# EasyEDA Pro project R7FA2E1A7_LED.eprj

# Schematic Schematic1
Create Date: 2023-08-11; Page Name: P1; Project Name: R7FA2E1A7_LED; Schematic Name: Schematic1; Update Date: 2023-08-11; Company: 嘉立创EDA; Page Size: A4; Version: V1.0
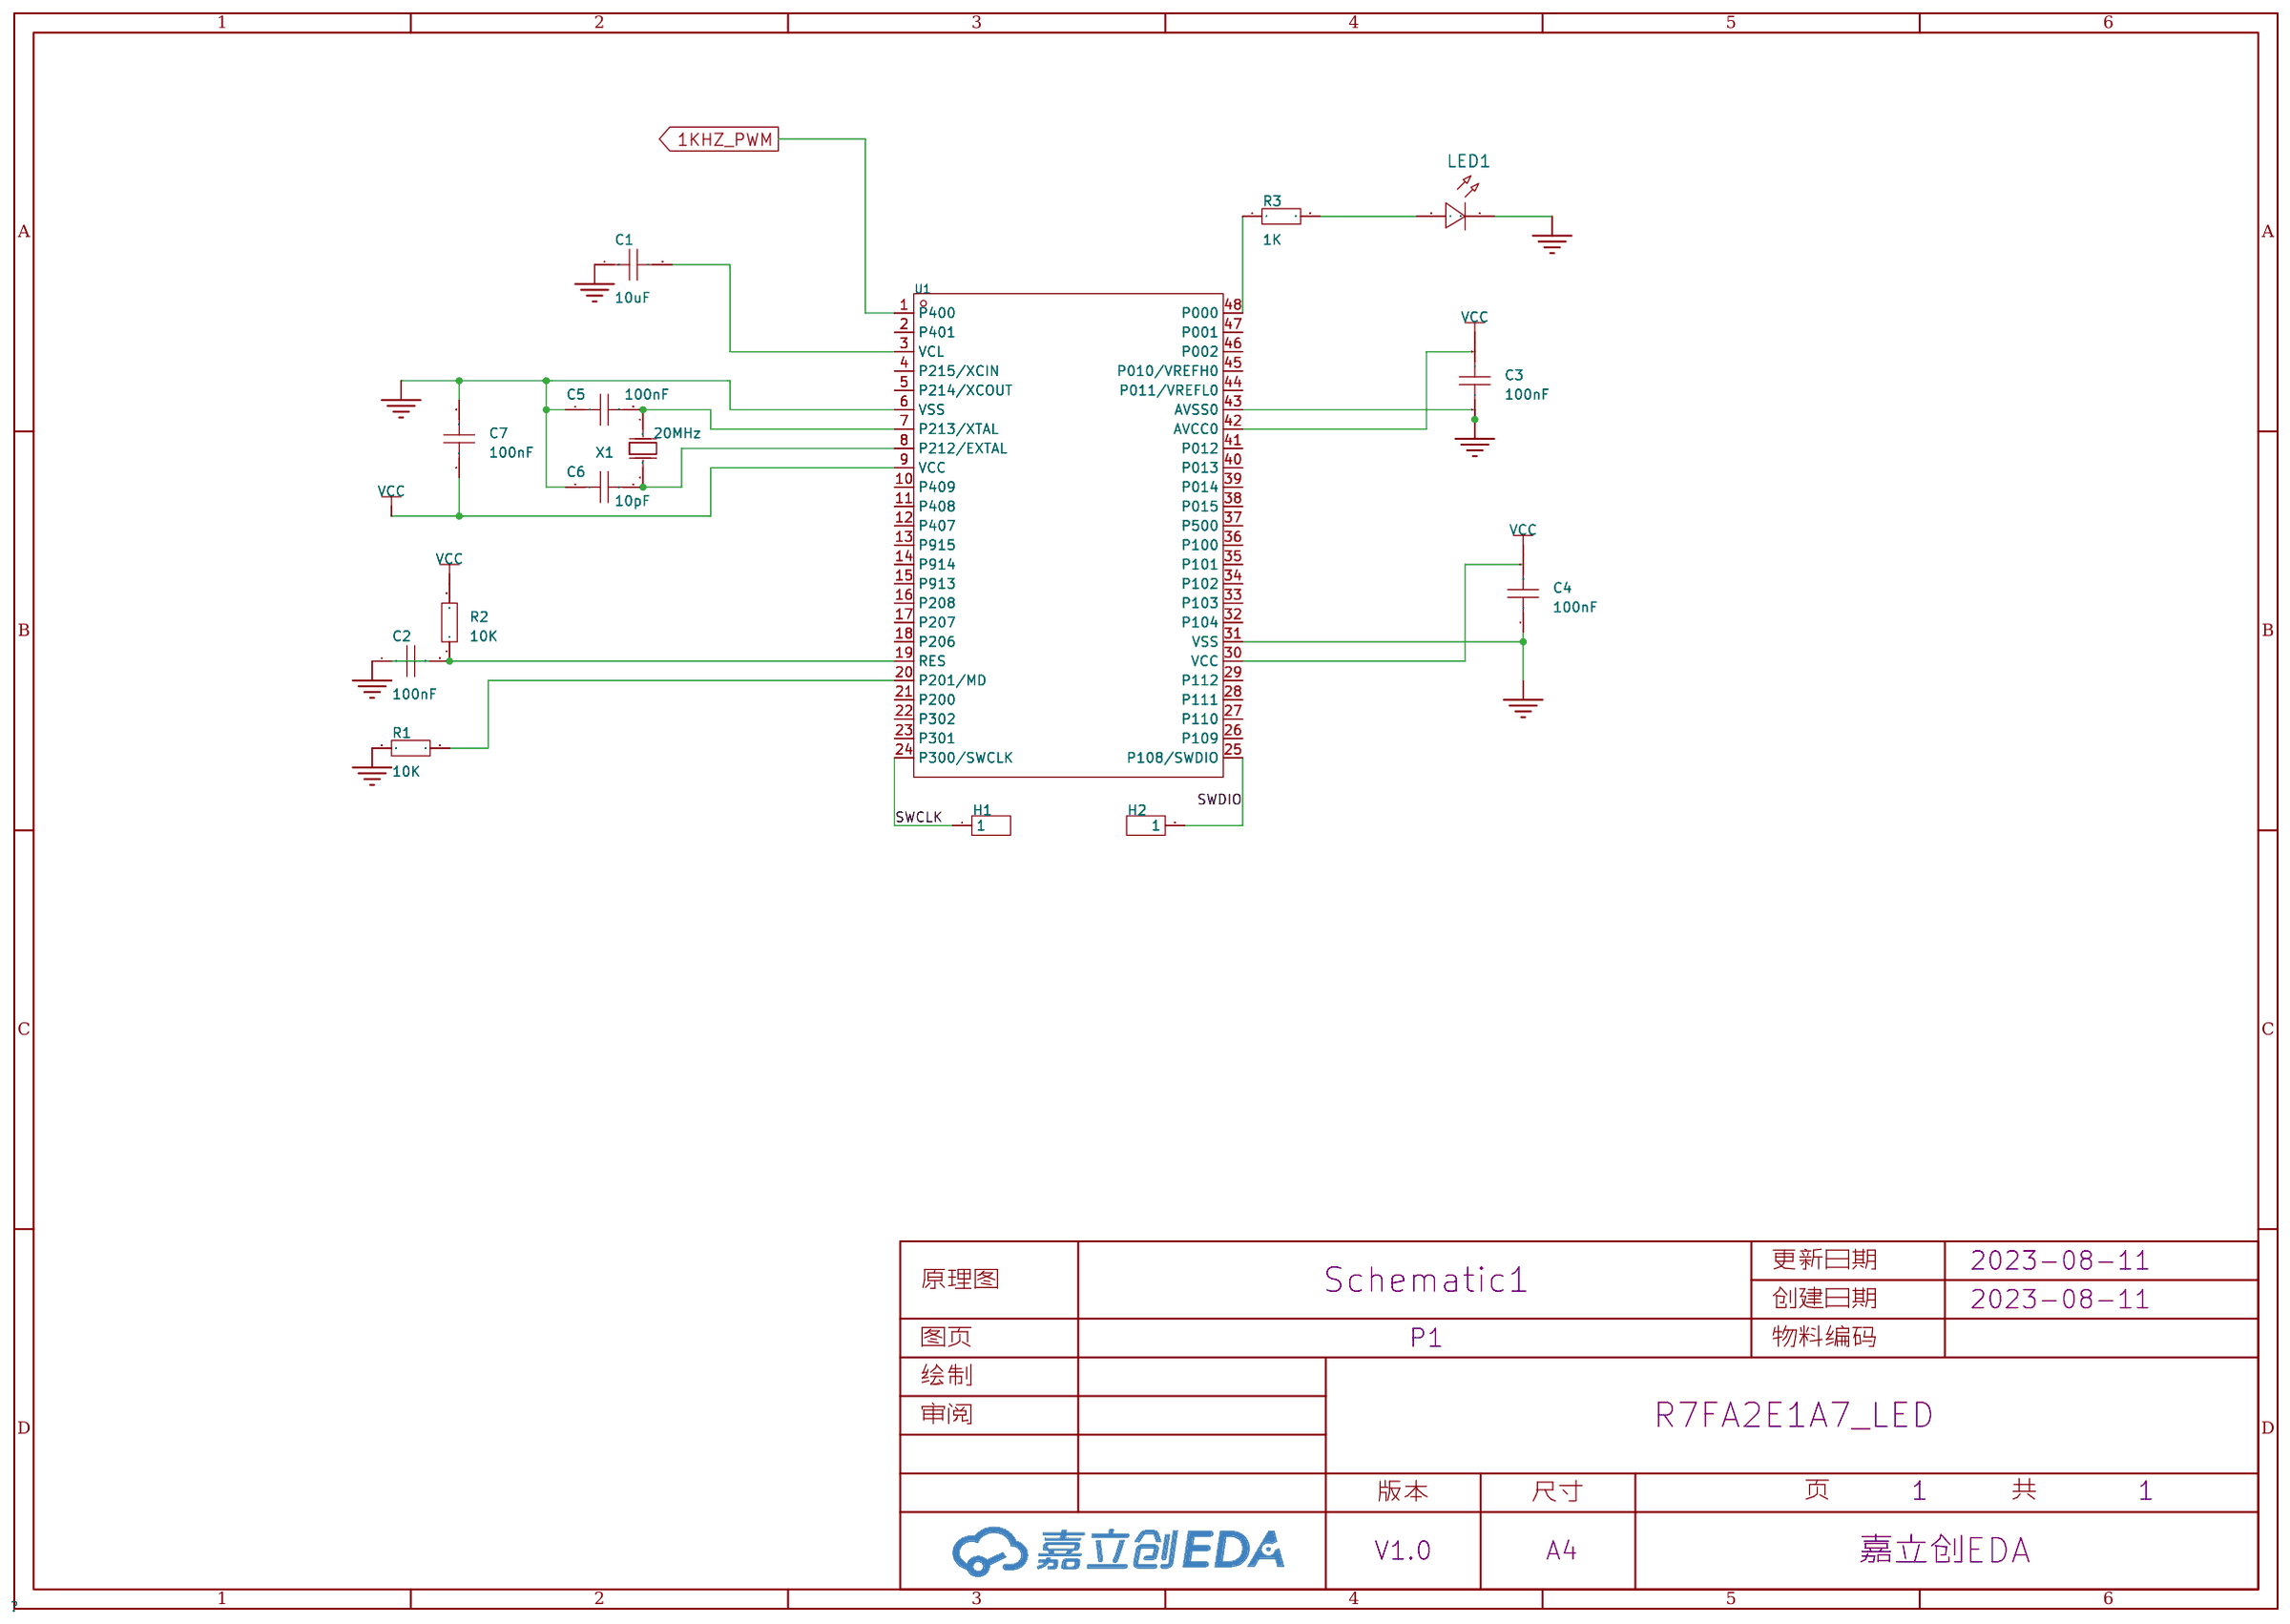
[diagram p0: schematic sheet]

## Parts
C1  10uF  [C0603]
C2  100nF  [C0603]
C3  100nF  [C0603]
C4  100nF  [C0603]
C5  100nF  [C0603]
C6  10pF  [C0603]
C7  100nF  [C0603]
H1  -  [HDR-TH_1P-V-M_XKB_X4611WV-01I-C28D40]
H2  -  [HDR-TH_1P-V-M_XKB_X4611WV-01I-C28D40]
LED1  -  [LED_0603]
R1  10K  [R0603]
R2  10K  [R0603]
R3  1K  [R0603]
U1  R7FA2E1A72DFL#AA0  [LQFP-48_L7.0-W7.0-P0.50-LS9.0-BL]
X1  20MHz  [OSC-TH_L10.0-W4.5-P5.00]

## Library data of the parts
C1-C7 = CAP_0603: Supplier Footprint: 0603
H1 H2 = HDR-M_2.54_1x1P: Supplier Part: C81276; Supplier Footprint: 插件; JLCPCB Part Class: Extended Part
LED1 = LED_0603-R: Supplier Footprint: 0603
R1-R3 = Res_0603: Supplier Footprint: 0603
U1 = R7FA2E1A72DFL#AA0: CPU内核:ARM Cortex-M23;CPU最大主频:48MHz;工作电压范围:1.6V~5.5V;程序存储容量:64KB;RAM总容量:16KB;GPIO端口数量:40;; Supplier Part: C2932201; Manufacturer: RENESAS(瑞萨)/IDT; Supplier Footprint: LQFP-48(7x7); JLCPCB Part Class: Extended Part; Datasheet: https://atta.szlcsc.com/upload/public/pdf/source/20211215/29BE301818A18D7F99D1A8CE53F7A919.pdf; Supplier: LCSC; CPU Core: ARM Cortex-M23; CPU Maximum Speed: 48MHz; Operating Voltage Range: 1.6V~5.5V; Program Storage Size: 64KB; RAM Size: 16KB; EEPROM: 4KB; GPIO Ports Number: 40; ADC (Bit): 12bit; Peripheral/Function: 触摸按键；安全加密; communication protocol: 以太网协议; Watchdog: 有; Real-Time Clock: 有; Low-Voltage Detect: 有; Direct Memory Access: 有; Operating Temperature Range: -40℃~+85℃
X1 = X49SD20MPB2SC: 频率:20MHz;频率公差:±10ppm;负载电容:15pF;; LCSC Part Name: 20MHz ±10ppm 15pF HC-49US; Supplier Part: C21499; Manufacturer: YXC(扬兴晶振); Supplier Footprint: HC-49S; JLCPCB Part Class: Extended Part; Datasheet: https://atta.szlcsc.com/upload/public/pdf/source/20210903/A997D130AE99CBB55D9024F9BE6DA174.pdf; Supplier: LCSC; Crystal Type: 49S晶振; Frequency Tolerance: ±10ppm; Frequency Stability: ±30ppm; Load Capacitance: 15pF; Operating Temperature: -20℃~+70℃

## Nets
GND: C1.1 C2.1 C3.1 C4.1 C5.1 C6.1 C7.2 LED1.1(C) R1.1 U1.6(VSS) U1.31(VSS) U1.43(AVSS0)
VCC: C3.2 C4.2 C7.1 R2.2 U1.9(VCC)
1KHZ_PWM: U1.1(P400)
SWCLK: H1.1 U1.24(P300/SWCLK)
SWDIO: H2.1 U1.25(P108/SWDIO)
Net-(C1-2): C1.2 U1.3(VCL)
Net-(C2-2): C2.2 R2.1 U1.19(RES)
Net-(C5-2): C5.2 U1.7(P213/XTAL) X1.1(OSC1)
Net-(C6-2): C6.2 U1.8(P212/EXTAL) X1.2(OSC2)
Net-(LED1-2): LED1.2(A) R3.2
Net-(R1-2): R1.2 U1.20(P201/MD)
Net-(R3-1): R3.1 U1.48(P000)

Not connected (* = marked no-connect by the designer): U1 2(P401) 4(P215/XCIN) 5(P214/XCOUT) 10(P409) 11(P408) 12(P407) 13(P915) 14(P914) 15(P913) 16(P208) 17(P207) 18(P206) 21(P200) 22(P302) 23(P301) 26(P109) 27(P110) 28(P111) 29(P112) 30(VCC) 32(P104) 33(P103) 34(P102) 35(P101) 36(P100) 37(P500) 38(P015) 39(P014) 40(P013) 41(P012) 42(AVCC0) 44(P011/VREFL0) 45(P010/VREFH0) 46(P002) 47(P001)
